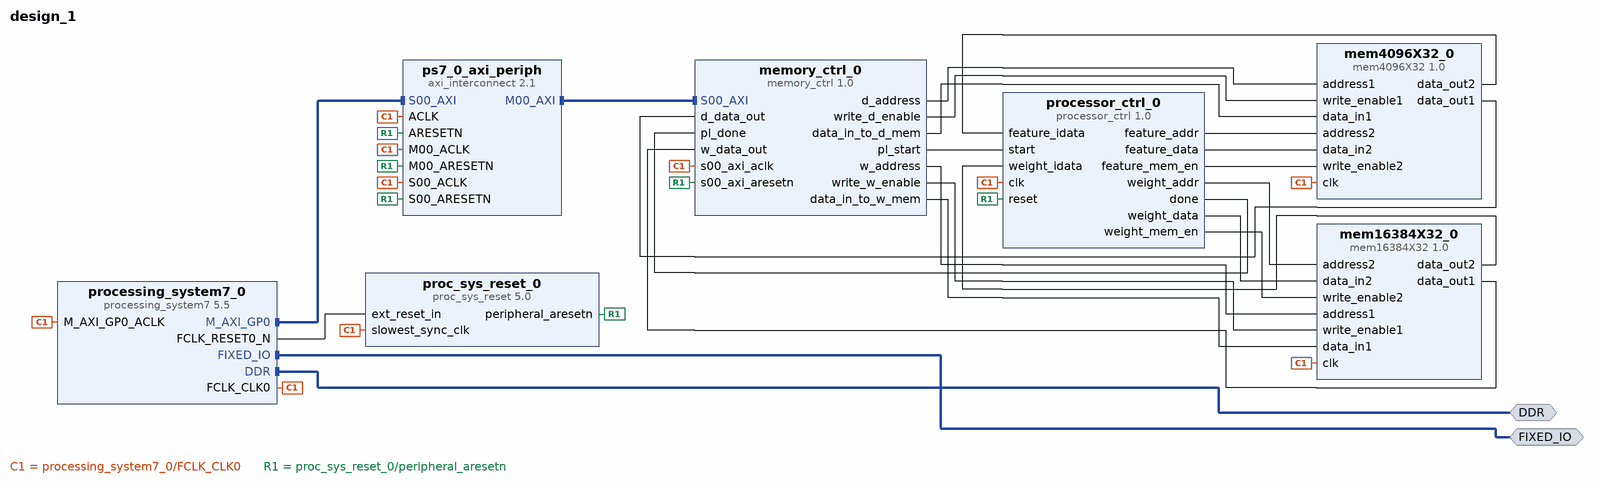
[diagram p0: block diagram of the top level]
# Vivado block design design_1, xc7z020clg400-1, Vivado 2018.3
create_bd_design design_1

create_bd_intf_port -mode Master -vlnv xilinx.com:interface:ddrx_rtl:1.0 DDR
create_bd_intf_port -mode Master -vlnv xilinx.com:display_processing_system7:fixedio_rtl:1.0 FIXED_IO

create_bd_cell -type ip -vlnv xilinx.com:ip:processing_system7:5.5 processing_system7_0
set_property -dict [list \
  CONFIG.PCW_APU_PERIPHERAL_FREQMHZ 650 \
  CONFIG.PCW_CRYSTAL_PERIPHERAL_FREQMHZ 50 \
  CONFIG.PCW_ENET0_ENET0_IO {MIO 16 .. 27} \
  CONFIG.PCW_ENET0_GRP_MDIO_ENABLE 1 \
  CONFIG.PCW_ENET0_GRP_MDIO_IO {MIO 52 .. 53} \
  CONFIG.PCW_ENET0_PERIPHERAL_ENABLE 1 \
  CONFIG.PCW_ENET0_RESET_ENABLE 1 \
  CONFIG.PCW_ENET0_RESET_IO {MIO 9} \
  CONFIG.PCW_ENET_RESET_ENABLE 1 \
  CONFIG.PCW_ENET_RESET_SELECT {Share reset pin} \
  CONFIG.PCW_FPGA0_PERIPHERAL_FREQMHZ 50 \
  CONFIG.PCW_FPGA1_PERIPHERAL_FREQMHZ 50 \
  CONFIG.PCW_GPIO_MIO_GPIO_ENABLE 1 \
  CONFIG.PCW_GPIO_MIO_GPIO_IO MIO \
  CONFIG.PCW_I2C_RESET_ENABLE 1 \
  CONFIG.PCW_M_AXI_GP0_FREQMHZ 10 \
  CONFIG.PCW_PERIPHERAL_BOARD_PRESET part0 \
  CONFIG.PCW_PRESET_BANK1_VOLTAGE {LVCMOS 1.8V} \
  CONFIG.PCW_QSPI_GRP_FBCLK_ENABLE 1 \
  CONFIG.PCW_QSPI_GRP_FBCLK_IO {MIO 8} \
  CONFIG.PCW_QSPI_GRP_SINGLE_SS_ENABLE 1 \
  CONFIG.PCW_QSPI_GRP_SINGLE_SS_IO {MIO 1 .. 6} \
  CONFIG.PCW_QSPI_PERIPHERAL_ENABLE 1 \
  CONFIG.PCW_QSPI_QSPI_IO {MIO 1 .. 6} \
  CONFIG.PCW_SD0_GRP_CD_ENABLE 1 \
  CONFIG.PCW_SD0_GRP_CD_IO {MIO 47} \
  CONFIG.PCW_SD0_GRP_WP_ENABLE 0 \
  CONFIG.PCW_SD0_PERIPHERAL_ENABLE 1 \
  CONFIG.PCW_SD0_SD0_IO {MIO 40 .. 45} \
  CONFIG.PCW_SDIO_PERIPHERAL_FREQMHZ 50 \
  CONFIG.PCW_SINGLE_QSPI_DATA_MODE x4 \
  CONFIG.PCW_UART0_PERIPHERAL_ENABLE 1 \
  CONFIG.PCW_UART0_UART0_IO {MIO 14 .. 15} \
  CONFIG.PCW_UART1_PERIPHERAL_ENABLE 0 \
  CONFIG.PCW_UART_PERIPHERAL_FREQMHZ 100 \
  CONFIG.PCW_UIPARAM_DDR_BUS_WIDTH {16 Bit} \
  CONFIG.PCW_UIPARAM_DDR_FREQ_MHZ 525 \
  CONFIG.PCW_UIPARAM_DDR_PARTNO {MT41J256M16 RE-125} \
  CONFIG.PCW_USB0_PERIPHERAL_ENABLE 1 \
  CONFIG.PCW_USB0_RESET_ENABLE 1 \
  CONFIG.PCW_USB0_RESET_IO {MIO 46} \
  CONFIG.PCW_USB0_USB0_IO {MIO 28 .. 39} \
  CONFIG.PCW_USB_RESET_ENABLE 1 \
  CONFIG.PCW_USB_RESET_SELECT {Share reset pin} \
] [get_bd_cells processing_system7_0]
# 486 more settings of processing_system7_0 are not shown: defaults, MIO pin electricals, DDR timing, and values the tool derives
create_bd_cell -type ip -vlnv xilinx.com:ip:proc_sys_reset:5.0 proc_sys_reset_0
create_bd_cell -type ip -vlnv xilinx.com:ip:axi_interconnect:2.1 ps7_0_axi_periph
set_property -dict {CONFIG.NUM_MI 1} [get_bd_cells ps7_0_axi_periph]
create_bd_cell -type ip -vlnv xilinx.com:user:mem4096X32:1.0 mem4096X32_0
create_bd_cell -type ip -vlnv xilinx.com:user:mem16384X32:1.0 mem16384X32_0
create_bd_cell -type ip -vlnv xilinx.com:user:memory_ctrl:1.0 memory_ctrl_0
create_bd_cell -type ip -vlnv xilinx.com:user:processor_ctrl:1.0 processor_ctrl_0

# ---- connections ----

connect_bd_intf_net [get_bd_intf_ports FIXED_IO] [get_bd_intf_pins processing_system7_0/FIXED_IO]
connect_bd_intf_net [get_bd_intf_pins ps7_0_axi_periph/M00_AXI] [get_bd_intf_pins memory_ctrl_0/S00_AXI]
connect_bd_intf_net [get_bd_intf_pins processing_system7_0/M_AXI_GP0] [get_bd_intf_pins ps7_0_axi_periph/S00_AXI]
connect_bd_intf_net [get_bd_intf_ports DDR] [get_bd_intf_pins processing_system7_0/DDR]
connect_bd_net [get_bd_pins processing_system7_0/FCLK_CLK0] \
  [get_bd_pins proc_sys_reset_0/slowest_sync_clk] [get_bd_pins processing_system7_0/M_AXI_GP0_ACLK] \
  [get_bd_pins ps7_0_axi_periph/S00_ACLK] [get_bd_pins ps7_0_axi_periph/M00_ACLK] [get_bd_pins ps7_0_axi_periph/ACLK] \
  [get_bd_pins mem4096X32_0/clk] [get_bd_pins mem16384X32_0/clk] [get_bd_pins memory_ctrl_0/s00_axi_aclk] \
  [get_bd_pins processor_ctrl_0/clk]
connect_bd_net [get_bd_pins proc_sys_reset_0/peripheral_aresetn] \
  [get_bd_pins ps7_0_axi_periph/S00_ARESETN] [get_bd_pins ps7_0_axi_periph/M00_ARESETN] \
  [get_bd_pins ps7_0_axi_periph/ARESETN] [get_bd_pins memory_ctrl_0/s00_axi_aresetn] [get_bd_pins processor_ctrl_0/reset]
connect_bd_net [get_bd_pins processing_system7_0/FCLK_RESET0_N] [get_bd_pins proc_sys_reset_0/ext_reset_in]
connect_bd_net [get_bd_pins memory_ctrl_0/d_address] [get_bd_pins mem4096X32_0/address1]
connect_bd_net [get_bd_pins memory_ctrl_0/write_d_enable] [get_bd_pins mem4096X32_0/write_enable1]
connect_bd_net [get_bd_pins memory_ctrl_0/data_in_to_d_mem] [get_bd_pins mem4096X32_0/data_in1]
connect_bd_net [get_bd_pins memory_ctrl_0/w_address] [get_bd_pins mem16384X32_0/address1]
connect_bd_net [get_bd_pins memory_ctrl_0/write_w_enable] [get_bd_pins mem16384X32_0/write_enable1]
connect_bd_net [get_bd_pins memory_ctrl_0/data_in_to_w_mem] [get_bd_pins mem16384X32_0/data_in1]
connect_bd_net [get_bd_pins mem4096X32_0/data_out1] [get_bd_pins memory_ctrl_0/d_data_out]
connect_bd_net [get_bd_pins mem16384X32_0/data_out1] [get_bd_pins memory_ctrl_0/w_data_out]
connect_bd_net [get_bd_pins processor_ctrl_0/feature_addr] [get_bd_pins mem4096X32_0/address2]
connect_bd_net [get_bd_pins processor_ctrl_0/feature_data] [get_bd_pins mem4096X32_0/data_in2]
connect_bd_net [get_bd_pins processor_ctrl_0/feature_mem_en] [get_bd_pins mem4096X32_0/write_enable2]
connect_bd_net [get_bd_pins processor_ctrl_0/weight_addr] [get_bd_pins mem16384X32_0/address2]
connect_bd_net [get_bd_pins processor_ctrl_0/weight_data] [get_bd_pins mem16384X32_0/data_in2]
connect_bd_net [get_bd_pins processor_ctrl_0/weight_mem_en] [get_bd_pins mem16384X32_0/write_enable2]
connect_bd_net [get_bd_pins processor_ctrl_0/done] [get_bd_pins memory_ctrl_0/pl_done]
connect_bd_net [get_bd_pins memory_ctrl_0/pl_start] [get_bd_pins processor_ctrl_0/start]
connect_bd_net [get_bd_pins mem4096X32_0/data_out2] [get_bd_pins processor_ctrl_0/feature_idata]
connect_bd_net [get_bd_pins mem16384X32_0/data_out2] [get_bd_pins processor_ctrl_0/weight_idata]

# ---- address map ----
assign_bd_address -offset 0x43C00000 -range 64K -target_address_space [get_bd_addr_spaces processing_system7_0/Data] [get_bd_addr_segs memory_ctrl_0/S00_AXI/S00_AXI_reg]

validate_bd_design
save_bd_design
